# Altium project PCB_RX_V2.5_C.PrjPcb
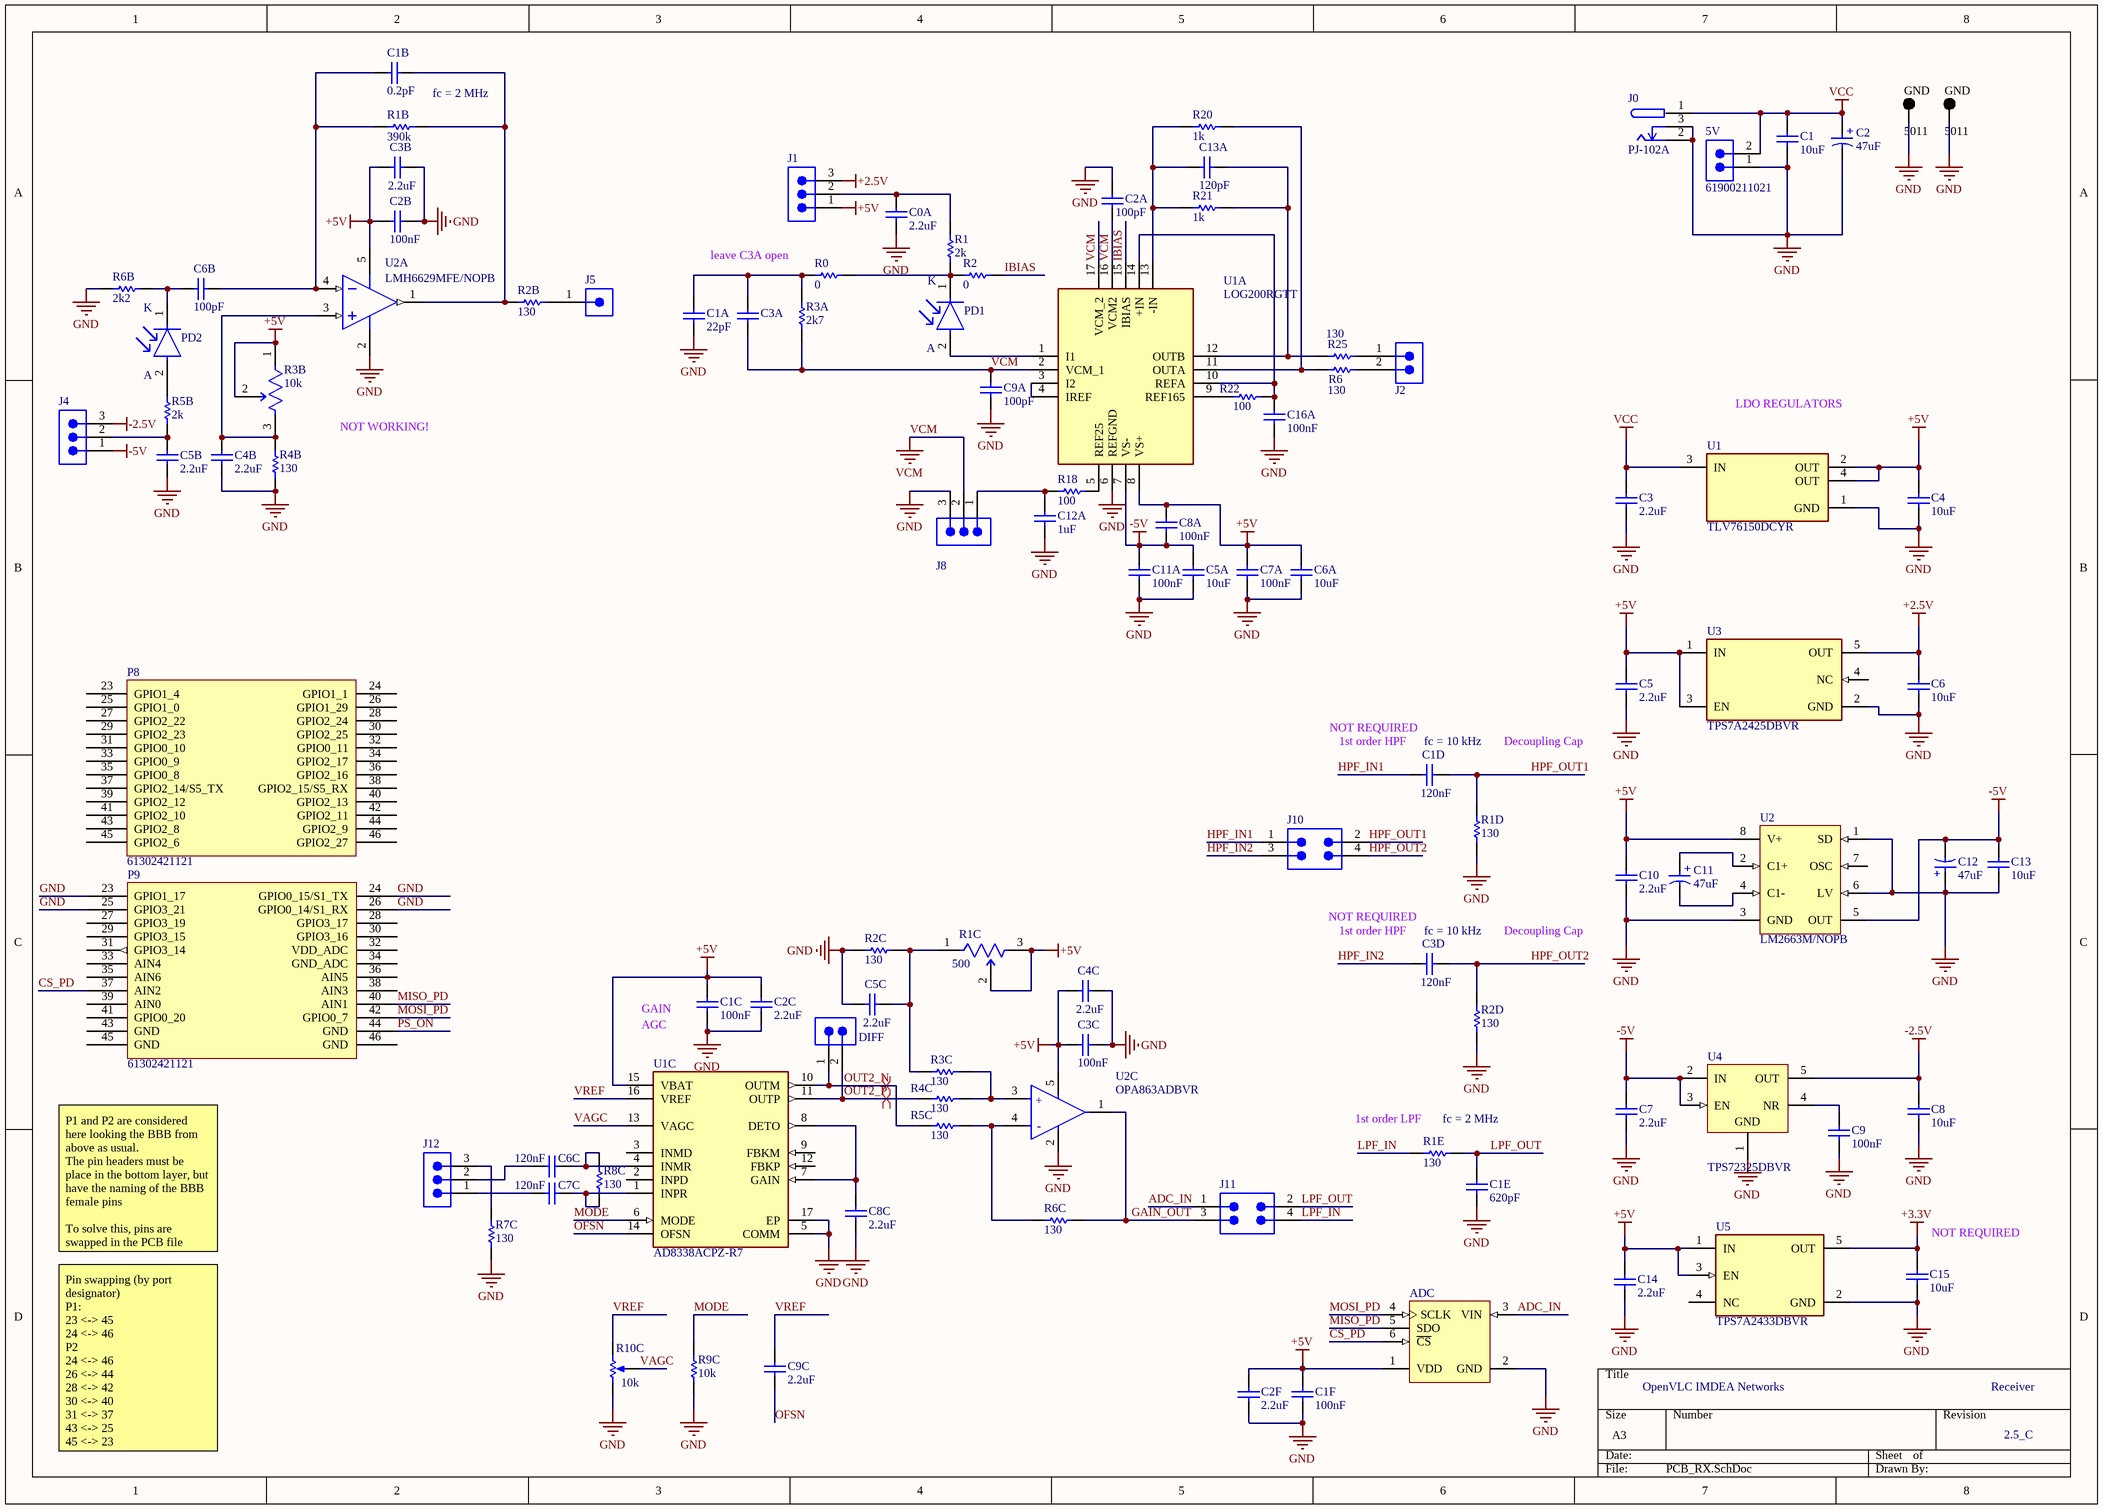
[diagram p0: PCB_RX.SchDoc]
1 sheet, 104 parts. Net scope: global (net labels, ports and power ports of the same name join across sheets).
Board file: PCB_RX.PcbDoc

## Sheet PCB_RX.SchDoc
size A3; SheetNumber: 1; SheetTotal: 1

### Parts
(Parts that share a designator on the sheet are numbered #1, #2 ... from top to bottom, then left to right.)
5V  61900211021  [61900211021]
ADC  ADS7886SBDBVR  [TI-DBV6_M]  (value not drawn)
C0A  value 2.2uF  [RESC1608X55N]  (hidden comment: Cap)
C1  value 10uF  [RESC1608X55N]  (hidden comment: Cap)
C1A  value 22pF  [RESC1608X55N]  (hidden comment: Cap)
C1B  value 0.2pF  [RESC1608X55N]  (hidden comment: Cap)
C1C  value 100nF  [RESC1608X55N]  (hidden comment: Cap)
C1D  value 120nF  [RESC1608X55N]  (hidden comment: Cap)
C1E  value 620pF  [RESC1608X55N]  (hidden comment: Cap)
C1F  value 100nF  [RESC1608X55N]  (hidden comment: Cap)
C2  47uF  [WCAP-PSLP_D5H5.5]
C2A  value 100pF  [RESC1608X55N]  (hidden comment: Cap)
C2B  value 100nF  [RESC1608X55N]  (hidden comment: Cap)
C2C  value 2.2uF  [RESC1608X55N]  (hidden comment: Cap)
C2F  value 2.2uF  [RESC1608X55N]  (hidden comment: Cap)
C3  value 2.2uF  [RESC1608X55N]  (hidden comment: Cap)
C3A  Cap  [RESC1608X55N]  (value not drawn)
C3B  value 2.2uF  [RESC1608X55N]  (hidden comment: Cap)
C3C  value 100nF  [RESC1608X55N]  (hidden comment: Cap)
C3D  value 120nF  [RESC1608X55N]  (hidden comment: Cap)
C4  value 10uF  [RESC1608X55N]  (hidden comment: Cap)
C4B  value 2.2uF  [RESC1608X55N]  (hidden comment: Cap)
C4C  value 2.2uF  [RESC1608X55N]  (hidden comment: Cap)
C5  value 2.2uF  [RESC1608X55N]  (hidden comment: Cap)
C5A  value 10uF  [RESC1608X55N]  (hidden comment: Cap)
C5B  value 2.2uF  [RESC1608X55N]  (hidden comment: Cap)
C5C  value 2.2uF  [RESC1608X55N]  (hidden comment: Cap)
C6  value 10uF  [RESC1608X55N]  (hidden comment: Cap)
C6A  value 10uF  [RESC1608X55N]  (hidden comment: Cap)
C6B  value 100pF  [RESC1608X55N]  (hidden comment: Cap)
C6C  value 120nF  [RESC1608X55N]  (hidden comment: Cap)
C7  value 2.2uF  [RESC1608X55N]  (hidden comment: Cap)
C7A  value 100nF  [RESC1608X55N]  (hidden comment: Cap)
C7C  value 120nF  [RESC1608X55N]  (hidden comment: Cap)
C8  value 10uF  [RESC1608X55N]  (hidden comment: Cap)
C8A  value 100nF  [RESC1608X55N]  (hidden comment: Cap)
C8C  value 2.2uF  [RESC1608X55N]  (hidden comment: Cap)
C9  value 100nF  [RESC1608X55N]  (hidden comment: Cap)
C9A  value 100pF  [RESC1608X55N]  (hidden comment: Cap)
C9C  value 2.2uF  [RESC1608X55N]  (hidden comment: Cap)
C10  value 2.2uF  [RESC1608X55N]  (hidden comment: Cap)
C11  47uF  [WCAP-PSLP_D5H5.5]
C11A  value 100nF  [RESC1608X55N]  (hidden comment: Cap)
C12  47uF  [WCAP-PSLP_D5H5.5]
C12A  value 1uF  [RESC1608X55N]  (hidden comment: Cap)
C13  value 10uF  [RESC1608X55N]  (hidden comment: Cap)
C13A  value 120pF  [RESC1608X55N]  (hidden comment: Cap)
C14  value 2.2uF  [RESC1608X55N]  (hidden comment: GRM188R6YA475KE15D)
C15  value 10uF  [RESC1608X55N]  (hidden comment: GRM188R6YA106MA73D)
C16A  value 100nF  [RESC1608X55N]  (hidden comment: Cap)
DIFF  61300211121  [61300211121]  (value not drawn)
GND#1  5011  [KSTN-5011_V]
GND#2  5011  [KSTN-5011_V]
J0  PJ-102A  [FP-PJ-102A-MFG]
J1  61300311121  [61300311121]  (value not drawn)
J2  61300211121  [61300211121]  (value not drawn)
J4  61300311121  [61300311121]  (value not drawn)
J5  61300111121  [61300111121]  (value not drawn)
J8  61300311121  [61300311121]  (value not drawn)
J10  61300421121  [61300421121]  (value not drawn)
J11  61300421121  [61300421121]  (value not drawn)
J12  61300311121  [61300311121]  (value not drawn)
P8  61302421121  [BBB_CAPE_NO_HEADER_R_24]
P9  61302421121  [BBB_CAPE_NO_HEADER_R_24]
PD1  BPW21R  [FP-6_511-5002_01-4-MFG]  (value not drawn)
PD2  BPW21R  [FP-6_511-5002_01-4-MFG]  (value not drawn)
R0  value 0  [RESC1608X55N]  (hidden comment: Res1)
R1  value 2k  [RESC1608X55N]  (hidden comment: Res1)
R1B  value 390k  [RESC1608X55N]  (hidden comment: Res1)
R1C  500  [FP-3296W-MFG]
R1D  value 130  [RESC1608X55N]  (hidden comment: Res1)
R1E  value 130  [RESC1608X55N]  (hidden comment: Res1)
R2  value 0  [RESC1608X55N]  (hidden comment: Res1)
R2B  value 130  [RESC1608X55N]  (hidden comment: Res1)
R2C  value 130  [RESC1608X55N]  (hidden comment: Res1)
R2D  value 130  [RESC1608X55N]  (hidden comment: Res1)
R3A  value 2k7  [RESC1608X55N]  (hidden comment: Res1)
R3B  10k  [FP-3296W-MFG]
R3C  value 130  [RESC1608X55N]  (hidden comment: Res1)
R4B  value 130  [RESC1608X55N]  (hidden comment: Res1)
R4C  value 130  [RESC1608X55N]  (hidden comment: Res1)
R5B  value 2k  [RESC1608X55N]  (hidden comment: Res1)
R5C  value 130  [RESC1608X55N]  (hidden comment: Res1)
R6  value 130  [RESC1608X55N]  (hidden comment: Res1)
R6B  value 2k2  [RESC1608X55N]  (hidden comment: Res1)
R6C  value 130  [RESC1608X55N]  (hidden comment: Res1)
R7C  value 130  [RESC1608X55N]  (hidden comment: Res1)
R8C  value 130  [RESC1608X55N]  (hidden comment: Res1)
R9C  value 10k  [RESC1608X55N]  (hidden comment: Res1)
R10C  10k  [BOUR-3362P]
R18  value 100  [RESC1608X55N]  (hidden comment: Res1)
R20  value 1k  [RESC1608X55N]  (hidden comment: Res1)
R21  value 1k  [RESC1608X55N]  (hidden comment: Res1)
R22  value 100  [RESC1608X55N]  (hidden comment: Res1)
R25  value 130  [RESC1608X55N]  (hidden comment: Res1)
U1  TLV76150DCYR  [FP-DCY0004A-MFG]
U1A  LOG200RGTT  [QFN50P300X300X100-17N-D]
U1C  AD8338ACPZ-R7  [FP-CP-16-22-IPC_C]
U2  LM2663M/NOPB  [D0008A_N]
U2A  LMH6629MFE/NOPB  [DBV0005A_L]
U2C  OPA863ADBVR  [FP-DBV0005A-MFG]
U3  TPS7A2425DBVR  [FP-DBV0005A-MFG]
U4  TPS72325DBVR  [DBV0005A_N]
U5  TPS7A2433DBVR  [FP-DBV0005A-MFG]

### Nets
+2.5V: C6.2 J1.3 U3.5(OUT)
+3.3V: C15.2 U5.5(OUT)
+5V: ADC.1(VDD) C1C.1 C1F.1 C2B.1 C2C.1 C2F.1 C3B.1 C3C.1 C4.2 C4C.1 C5.2 C6A.1 C7A.1 C8A.1 C10.2 C14.2 J1.1 R1C.2(WIPER) R1C.3(CW) R3B.1(CCW) R3B.2(WIPER) U1.2(OUT) U1.4(OUT) U1A.8(VS+) U1C.15(VBAT) U2.8(V+) U2A.5(V+) U2C.5(VS+) U3.1(IN) U3.3(EN) U5.1(IN) U5.3(EN)
-2.5V: C8.2 J4.3 U4.5(OUT)
-5V: C5A.1 C7.2 C8A.2 C11A.1 C12.2(N) C13.2 J4.1 U1A.7(VS-) U2.5(OUT) U4.2(IN) U4.3(EN)
GND: 5V.1 ADC.2(GND) C0A.1 C1.2 C1A.1 C1C.2 C1E.2 C1F.2 C2.2(N) C2A.1 C2B.2 C2C.2 C2F.2 C3.1 C3B.2 C3C.2 C4.1 C4B.1 C4C.2 C5.1 C5A.2 C5B.1 C5C.1 C6.1 C6A.2 C7.1 C7A.2 C8.1 C8C.1 C9.1 C9A.2 C10.1 C11A.2 C12.1(P) C12A.2 C13.1 C14.1 C15.1 C16A.2 GND#1.1 GND#2.1 J0.2 J0.3 J8.3 P9.23(GPIO1_17) P9.24(GPIO0_15/S1_TX) P9.25(GPIO3_21) P9.26(GPIO0_14/S1_RX) R1D.2 R2C.2 R2D.2 R4B.2 R6B.1 R7C.2 R9C.1 R10C.1(CCW) U1.1(GND) U1A.6(REFGND) U1C.5(COMM) U1C.17(EP) U2.1(SD) U2.3(GND) U2.6(LV) U2A.2(V-) U2C.2(VS-) U3.2(GND) U4.1(GND) U5.2(GND)
VCC: 5V.2 C1.1 C2.1(P) C3.2 J0.1 U1.3(IN)
VCM: C2A.2 C3A.2 C9A.1 J8.2 R3A.1 U1A.2(VCM_1) U1A.16(VCM2) U1A.17(VCM_2)
ADC_IN: ADC.3(VIN) J11.1
CS_PD: ADC.6(~{CS}) P9.37(AIN2)
GAIN_OUT: J11.3 R6C.1 U2C.1(VOUT)
HPF_IN1: C1D.1 J10.1
HPF_IN2: C3D.1 J10.3
HPF_OUT1: C1D.2 J10.2 R1D.1
HPF_OUT2: C3D.2 J10.4 R2D.1
IBIAS: R2.2 U1A.15(IBIAS)
LPF_IN: J11.4 R1E.2
LPF_OUT: C1E.1 J11.2 R1E.1
MISO_PD: ADC.5(SDO) P9.40(AIN1)
MODE: R9C.2 U1C.6(MODE)
MOSI_PD: ADC.4(SCLK) P9.42(GPIO0_7)
OFSN: C9C.1 U1C.14(OFSN)
OUT2_N: DIFF.1 R5C.2 U1C.10(OUTM)
OUT2_P: DIFF.2 R4C.2 U1C.11(OUTP)
PS_ON: P9.44(GND)
VAGC: R10C.2(S) U1C.13(VAGC)
VREF: C9C.2 R10C.3(CW) U1C.16(VREF)
NetC0A_2: C0A.2 J1.2 R1.2
NetC1A_2: C1A.2 C3A.1 R0.1 R3A.2
NetC1B_1: C1B.1 C6B.1 R1B.2 U2A.4(IN-)
NetC1B_2: C1B.2 R1B.1 R2B.2 U2A.1(OUT)
NetC4B_2: C4B.2 R3B.3(CW) R4B.1 U2A.3(IN+)
NetC5B_2: C5B.2 J4.2 R5B.2
NetC5C_2: C5C.2 R1C.1(CCW) R2C.1 R3C.2
NetC6B_2: C6B.2 PD2.1(C) R6B.2
NetC6C_1: C6C.1 J12.2
NetC6C_2: C6C.2 R8C.1 U1C.4(INMR)
NetC7C_1: C7C.1 J12.1
NetC7C_2: C7C.2 R8C.2 U1C.1(INPR)
NetC8C_2: C8C.2 U1C.7(GAIN) U1C.8(DETO)
NetC9_2: C9.2 U4.4(NR)
NetC11_1: C11.1(P) U2.2(C1+)
NetC11_2: C11.2(N) U2.4(C1-)
NetC12A_1: C12A.1 J8.1 R18.1
NetC13A_1: C13A.1 R20.1 R21.1 U1A.13(-IN)
NetC13A_2: C13A.2 R21.2 R25.2 U1A.12(OUTB)
NetC16A_1: C16A.1 R22.2 U1A.10(REFA) U1A.14(+IN)
NetJ2_1: J2.1 R25.1
NetJ2_2: J2.2 R6.1
NetJ5_1: J5.1 R2B.1
NetJ12_3: J12.3 R7C.1
NetPD1_1: PD1.1(C) R0.2 R1.1 R2.1
NetPD1_2: PD1.2(A) U1A.1(I1)
NetPD2_2: PD2.2(A) R5B.1
NetR3C_1: R3C.1 R4C.1 U2C.3(VIN+)
NetR5C_1: R5C.1 R6C.2 U2C.4(VIN-)
NetR6_2: R6.2 R20.2 U1A.11(OUTA)
NetR18_2: R18.2 U1A.5(REF25)
NetR22_1: R22.1 U1A.9(REF165)
NetU1A_3: U1A.3(I2) U1A.4(IREF)

Not connected (* = marked no-connect by the designer): P8 23(GPIO1_4) 24(GPIO1_1) 25(GPIO1_0) 26(GPIO1_29) 27(GPIO2_22) 28(GPIO2_24) 29(GPIO2_23) 30(GPIO2_25) 31(GPIO0_10) 32(GPIO0_11) 33(GPIO0_9) 34(GPIO2_17) 35(GPIO0_8) 36(GPIO2_16) 37(GPIO2_14/S5_TX) 38(GPIO2_15/S5_RX) 39(GPIO2_12) 40(GPIO2_13) 41(GPIO2_10) 42(GPIO2_11) 43(GPIO2_8) 44(GPIO2_9) 45(GPIO2_6) 46(GPIO2_27); P9 27(GPIO3_19) 28(GPIO3_17) 29(GPIO3_15) 30(GPIO3_16) 31(GPIO3_14) 32(VDD_ADC) 33(AIN4) 34(GND_ADC) 35(AIN6) 36(AIN5) 38(AIN3) 39(AIN0) 41(GPIO0_20) 43(GND) 45(GND) 46(GND); U1C 2(INPD) 3(INMD) 9(FBKM) 12(FBKP); U2 7(OSC); U3 4(NC); U5 4(NC)

### Layout directives
differential pair: OUT2_N, OUT2_P

### Notes on the sheet
- fc = 2 MHz
- K
- (near R0) leave C3A open
- A
- (near PD1) A
- NOT WORKING!
- LDO REGULATORS
- (near C1D) NOT REQUIRED
- (near C1D) 1st order HPF
- (near C1D) fc = 10 kHz
- Decoupling Cap
- NOT REQUIRED
- (near C3D) 1st order HPF
- (near C3D) fc = 10 kHz
- AGC
- (near C1C) GAIN
- (near R1E) 1st order LPF
- (near R1E) fc = 2 MHz
- P1 and P2 are considered here looking the BBB from above as usual.
  The pin headers must be place in the bottom layer, but have the naming of the BBB female pins
  To solve this, pins are swapped in the PCB file
- (near C15) NOT REQUIRED
- OpenVLC IMDEA Networks
- Receiver
- Pin swapping (by port designator)
  P1:
  23 <-> 45
  24 <-> 46
  P2
  24 <-> 46
  26 <-> 44
  28 <-> 42
  30 <-> 40
  31 <-> 37
  43 <-> 25
  45 <-> 23
- 2.5_C
- (in symbol CMP-00370-145533195-1) +; -
- (in symbol CMP-03913-53758736-1) +

### Library data of the parts
5V = CMP-1502-00592-2: NexarPartId: 18818217; Gender: Male; Insulation Resistance: 1GΩ; Voltage Rating: 250V; Contact Resistance: 20mΩ; Connector Type: Male Pin; Number of Positions: 2; Insulation: Insulated; Current Rating: 3A; Pitch: 2.54mm; Contact Mating Length: 7.62mm; Packaging: Bulk; Contact Plating: Tin; REACH SVHC: Unknown; Height: 3.2mm; Lead Pitch: 2.54mm; Color: Beige; Flammability Rating: UL94 V-0; RoHS: Compliant; Operating Supply Voltage: 250V; Length: 5.08mm; Number of Pins: 2; Max Operating Temperature: 105°C; Number of Rows: 1; Min Operating Temperature: -40°C; Contact Material: Copper; Mount: Through Hole; Housing Material: Nylon; Width: 5.12mm; Fastening Type: Friction; Contact Gender: Male; Number of Contacts: 2; Termination: Through Hole
ADC = CMP-0003-00246-2: 2.35 to 5.25 V, 12-Bit, 1 MSPS, Serial ADC, -40 to 125 degC, 6-pin SOT23 (DBV6), Green (RoHS & no Sb/Br); Manufacturer: Texas Instruments; Sample Rate (max)(SPS): 1M; INL(Max)(+/-LSB): 1.25; Digital Supply(Min)(V): 2.35; SNR(dB): 71.25; Interface: Serial SPI; Resolution(Bits): 12; SubFamily: Precision ADC (<=10MSPS); # Input Channels: 1; Digital Supply(Max)(V): 5.25; SFDR(dB): 85.5; Architecture: SAR; PackageDescription: 6-Pin Plastic Small Outline, Body 1.6 x 2.9 mm, Pitch 0.95 mm; ComponentLink1URL: http://www.ti.com/; PackageReference: DBV6; PartNumber: ADS7886SBDBVR; ComponentLink1Description: Manufacturer URL; ComponentLink2Description: Datasheet; Code_JEDEC: MO-178; ComponentLink3URL: http://www.ti.com/litv/pdf/mpds026h; ComponentLink2URL: http://www.ti.com/general/docs/lit/getliterature.tsp?genericPartNumber=ADS7886&fileType=pdf; ComponentLink3Description: Package Specification; Eco-Plan: Green (RoHS & no Sb/Br); Analog Voltage AV/DD(Min)(V): 2.35; DatasheetVersion: SLAS492A; SINAD(dB): 71.25; Mounting Technology: Surface Mount; PackageVersion: 4073253-5/K, 03/2006; Analog Voltage AV/DD(Max)(V): 5.25
C0A C1 C1A C1B C1C C1D C1E C1F C2A C2B C2C C2F C3 C3A C3B C3C C3D C4 C4B C4C C5 C5A C5B C5C C6 C6A C6B C6C C7 C7A C7C C8 C8A C8C C9 C9A C9C C10 C11A C12A C13 C13A C14 C15 C16A = Cap: Capacitor; Published: 8-Jun-2000; LatestRevisionDate: 17-Jul-2002; LatestRevisionNote: Re-released for DXP Platform.; PackageReference: RAD-0.3; Publisher: Altium Limited; PackageDescription: Radial Cap, Thru-Hole; 2 Leads; 0.3 in Pin Spacing
C2 C11 C12 = CMP-03913-53758736-1: 875105242006 WCAP-PSLP Aluminum Polymer Capacitors; Voltage Rating (DC): 10V; Life (Hours): 2000hours; ESR (Equivalent Series Resistance): 30mΩ; Ripple Current: 1.97A; Leakage Current: 300µA; Capacitance: 47µF; Polarity: Polar; Pitch: 5.3mm; Tolerance: 20%; Diameter: 5mm; Length: 5.5mm; RoHS: Compliant; Packaging: Tape & Reel (TR); Case/Package: Radial; REACH SVHC: Unknown; Max Operating Temperature: 105°C; Min Operating Temperature: -55°C; Mount: Surface Mount; Voltage Rating: 10V; Height - Seated (Max): 5.5118mm; NexarPartId: 53758736
DIFF J2 = CMP-1712-00002-6: NexarPartId: 20081794; Number of Contacts: 2; Pitch: 2.54mm; Connector Type: Male Pin; Voltage Rating: 250V; Current Rating: 3A; Gender: Male; Contact Resistance: 20mΩ; Height: 8.94mm; Lead Free: Lead Free; Number of Pins: 2; Termination: Through Hole; RoHS: Compliant; Lead Pitch: 2.54mm; REACH SVHC: No SVHC; Housing Material: PBT; Contact Mating Length: 5.9944mm; Min Operating Temperature: -40°C; Orientation: Vertical; Contact Material: Copper; Contact Gender: Male; Max Operating Temperature: 125°C; Number of Rows: 1; Number of Positions: 2; Packaging: Bulk; Contact Plating: Gold; Mount: Through Hole; Color: Black; Operating Supply Voltage: 250V
GND#1 GND#2 = CMP-1672-00003-4: Test Point, Black, Through Hole, RoHS, Bulk; Manufacturer: Keystone; ComponentLink2URL: http://www.keyelco.com/product-pdf.cfm?p=1320; Colour: Black; Pins: 1; REACH SVHC: No SVHC; ComponentLink1URL: http://www.keyelco.com/; PackageReference: 5011; Contact Plating: Silver; Package Quantity: 100; Packaging: Bulk; RoHSCompliant: true; Height: 8.12 mm; PackageDescription: 1-Pin Through Hole Device, Dia 3.17 mm; Mount: Through Hole; Mounting Technology: Through Hole; DatasheetVersion: Rev. F, 12/2013; ComponentLink1Description: Manufacturer URL; Contact Material: Bronze; ComponentLink2Description: Datasheet
J0 = CMP-12637-106234071-1: PJ-102A 2.0 x 6.5 mm, 2.5 A, Horizontal, Through Hole, Tapered Pins, Dc Power Jack Connector; Voltage Rating (DC): 24V; Number of Contacts: 3; Outside Diameter: 6.5mm; Gender: Male; Shielding: No; Insulation Resistance: 50MΩ; Current Rating: 2.5A; Inside Diameter: 2mm; Number of Conductors: 2; Housing Color: Black; RoHS: Compliant; Diameter: 2.1mm; Mount: Through Hole; Contact Plating: Nickel; NexarPartId: 106234071; Voltage Rating: 24V; Housing Material: Thermoplastic; Max Operating Temperature: 85°C; Color: Black; Contact Material: Copper, Nickel, Tin; Orientation: Horizontal; Packaging: Bulk; Flammability Rating: UL94 V-0; Schedule B: 8536695050, 8536695050; Contact Gender: Male; Lead Free: Lead Free; Termination: Through Hole; Min Operating Temperature: -25°C; Height: 11.2mm; Lifecycle Status: Production
J1 J4 J8 J12 = CMP-1502-01062-3: NexarPartId: 32855521; Current Rating: 3A; Voltage Rating: 250V; Number of Positions: 3; Pitch: 2.54mm; Contact Resistance: 20mΩ; Connector Type: Male Pin; Gender: Male; REACH SVHC: Unknown; Packaging: Bulk; Contact Material: Copper; Min Operating Temperature: -40°C; Number of Rows: 1; Orientation: Vertical; RoHS: Compliant; Contact Plating: Gold; Max Operating Temperature: 105°C; Mount: Through Hole; Height: 8.94mm; Operating Supply Voltage: 250V; Number of Pins: 3; Contact Mating Length: 5.9944mm; Number of Contacts: 3; Color: Black; Lead Free: Lead Free; Lead Pitch: 2.54mm; Termination: Solder
J5 = CMP-1502-01058-3: NexarPartId: 32855518; Current Rating: 3A; Connector Type: Male Pin; Number of Positions: 1; Contact Resistance: 20mΩ; Gender: Male; Operating Supply Voltage: 250V; Orientation: Vertical; Contact Mating Length: 5.9944mm; Termination: Solder; Number of Rows: 1; Number of Pins: 1; Mount: Through Hole; RoHS: Compliant; Contact Material: Copper; Color: Black; Lead Pitch: 2.54mm; Number of Contacts: 1; Contact Plating: Gold; Packaging: Bulk; REACH SVHC: Unknown
J10 J11 = CMP-1502-01066-4: NexarPartId: 32855524; Number of Positions: 4; Operating Supply Voltage: 250V; Pitch: 2.54mm; Connector Type: Male Pin; Current Rating: 3A; Contact Resistance: 20mΩ; Gender: Male; Number of Pins: 4; Max Operating Temperature: 105°C; Number of Contacts: 4; Contact Mating Length: 5.9944mm; Min Operating Temperature: -40°C; Orientation: Vertical; Height: 8.89mm; Mount: Through Hole; Lead Pitch: 2.54mm; Contact Material: Copper; Color: Black; Voltage Rating: 250V; RoHS: Compliant; Termination: Solder; Row Spacing: 2.54mm; Contact Plating: Gold; Number of Rows: 2; Lead Free: Lead Free; REACH SVHC: Unknown; Packaging: Bulk
P8 = BBB_P8_reduced
P9 = BBB_P9_reduced
PD1 PD2 = CMP-2000-05428-2: SENSOR PHOTODIODE 565NM RADIAL; Manufacturer: Vishay; Dark Current: 0.002uA; Viewing Angle: 100°; Max Junction Temp: +125°C; Response Time: 3.1us; Reverse Breakdown Voltage: 10V; Power Dissipation: 300mW; Forward Voltage: 1V; Forward Current: 50mA; Digikey Description: SENSOR PHOTODIODE 565NM RADIAL; RoHS: TRUE; Temperature: -40°C to +125°C; Device Class L1: Sensors; Device Class L2: Optical Sensors; Lead Free: Yes; Device Class L3: Photodiodes; Category: Diode; Manufacturer Part Number: BPW21R; Height: 3.3mm; Octopart: https://octopart.com/bpw21r-vishay-39390634; Sensor Output: Photodiode; Automotive: No; Package: 6.511-5002.01-4; Mouser Description: Photodiodes 50 Degree 300mW; Ambient Temperature Range Low: -40°C; Temperature Range Low: -40°C; Temperature Range High: +125°C; ComponentLink2URL: http://www.vishay.com/docs/81519/bpw21r.pdf; ComponentLink2Description: Datasheet; Wavelength: 565nm; Ambient Temperature Range High: +125°C
R0 R1 R1B R1D R1E R2 R2B R2C R2D R3A R3C R4B R4C R5B R5C R6 R6B R6C R7C R8C R9C R18 R20-R22 R25 = Res1: Resistor; Published: 8-Jun-2000; LatestRevisionDate: 17-Jul-2002; LatestRevisionNote: Re-released for DXP Platform.; PackageReference: AXIAL-0.3; Publisher: Altium Limited; PackageDescription: Axial Device, Thru-Hole; 2 Leads; 0.3 in Pin Spacing
R1C R3B = CMP-1747-00001-8: TRIMMER 10K OHM 0.5W PC PIN TOP; Number of Turns: 25; Tolerance: 10%; Resistance: 10kR; Max Power Dissipation: 500mW; Temperature Coefficient: 100ppm/°C; Insulation Resistance: 1GR; Min Operating Temperature: -55°C; Resistor Type: Cermet; Series: 3296; Color: Blue; Mount: Through Hole; Taper: Linear; Radiation Hardening: No; RoHS Compliant: Yes; Width: 9.53mm; Resistance Tolerance: 10%; Contact Plating: Tin; Military Standard: Not; Package Quantity: 50; Weight: 0.03oz; Lead Free: Lead Free; Power Rating: 500mW; Termination: Pin; Technology: CERMET; Max Operating Temperature: 125°C; Packaging: Rail/Tube; Length: 9.53mm; Depth: 4.83mm; Height: 11.55mm; Reach SVHC Compliant: Yes
R10C = CMP-1747-00004-1: Square Trimpot(R) Trimming Potentiometer, 10 KOhm, 300 V, -55 to 125 degC, 3-Pin THD, RoHS, Tube; Voltage Rating: 220 mV; Power Rating: 1 W; Tolerance: 1%; Resistance: 50 mohm; Case/Package: 1206; Length: 3.2 mm; RoHSCompliant: True; PackageDescription: 3-Pin Through Hole Device, Body 6.6 x 6.99 mm, Pitch 2.54 mm; ComponentLink2Description: Datasheet; REACH SVHC: No SVHC; Mount: Surface Mount; Height: 0.6 mm; Packaging: Tape and Reel; ComponentLink1URL: http://www.bourns.com/; Case Code (Imperial): 0612; Pins: 2; Case Code (Metric): 1632; ComponentLink2URL: http://www.bourns.com/docs/Product-Datasheets/3362.pdf; Min Operating Temperature: -25degC; ComponentLink1Description: Manufacturer URL; PackageReference: 3326P; Max Operating Temperature: 125degC; Width: 1.6 mm; Package Quantity: 5000; DatasheetVersion: May-16
U1 = CMP-00370-134324849-1: TLV76150DCYR 1-A 16-V high-PSRR linear voltage regulator 4-SOT-223 -40 to 125; Manufacturer Lifecycle Status: ACTIVE; Number of Channels: 1; Min Supply Voltage: 6.5V; Nominal Supply Current: 65µA; Dropout Voltage: 900mV; Accuracy: 1%; Max Supply Voltage: 16V; Max Junction Temperature (Tj): 125°C; Output Current: 1A; Output Voltage: 5V; Width: 3.5mm; Length: 6.5mm; NexarPartId: 134324849; Max Operating Temperature: 125°C; Thickness: 1.6mm; Min Operating Temperature: -40°C; Case/Package: SOT-223; Height: 1.8mm; Lifecycle Status: Production; Number of Pins: 4; Number of Outputs: 1
U1A = LOG200RGTT: Logarithmic Amplifiers High-speed precision logarithmic amplifier with photodiode bias and dark-current correction; Manufacturer_Name: Texas Instruments; Geometry.Height: 1mm; Manufacturer_Part_Number: LOG200RGTT; Mouser Part Number: *; Mouser Price/Stock: *; Arrow Part Number: *; Arrow Price/Stock: *; Datasheet Link: https://www.ti.com/lit/ds/symlink/log200.pdf?ts=1737720734287&ref_url=https%253A%252F%252Fwww.mouser.es%252F
U1C = CMP-09116-000032-1: IC OPAMP VGA 1 CIRCUIT 16LFCSP; Manufacturer: Analog Devices; Nominal Supply Current: 3-6mA; Max Supply Voltage: 5V; Number Of Channels: 1; Output Current Per Channel: 5mA; Max Junction Temp: +150°C; Min Supply Voltage: 3V; Bandwidth: 18MHz; Voltage Gain: 80dB; Mouser Description: Special Purpose Amplifiers Ultra Low Pwr 18MHz SGL CH VGA; Device Class L2: Linear ICs; Ipc Land Pattern Name: QFN50P300X300X75-16; Temperature Range Low: -40°C; Device Class L1: Integrated Circuits (ICs); RoHS: TRUE; Digikey Description: IC OPAMP VGA 1 CIRCUIT 16LFCSP; Category: IC; ComponentLink2URL: https://www.analog.com/media/en/technical-documentation/data-sheets/AD8338.pdf; Automotive: No; Height: 0.8mm; Manufacturer Part Number: AD8338ACPZ-R7; Octopart: https://octopart.com/ad8338acpz-r7-analog+devices-21054770; Temperature: -40°C to +85°C; ComponentLink2Description: Datasheet; Lead Free: Yes; Temperature Range High: +85°C; Package: CP-16-22; Device Class L3: Amplifiers - Op Amps
U2 = CMP-0065-00037-3: Switched Capacitor Voltage Converter, 8-pin Narrow SOIC, Pb-Free; Manufacturer: Texas Instruments; PackageTopMarking: NSZXTT*LM26*63M; CompType: Switch Caps; PowerWise: N; Code_IPC: SOIC127P600-8; PinCount: 8; ComponentLink1Description: Datasheet URL; PackageReference: D0008A; Code_JEDEC: MS-012-AA; PackageDescription: SOIC Narrow, 4.9 x 3.9 x 1.45mm, 8 Lead, 1.27mm Pitch; ComponentLink1URL: http://www.ti.com/general/docs/lit/getliterature.tsp?genericPartNumber=LM2663&fileType=pdf; RoHS: Y
U2A = CMP-0055-01619-3: Ultra-Low Noise, High-Speed Operational Amplifier with Shutdown, 5-pin SOT-23, 250 Reel; Manufacturer: Texas Instruments; High-Reliability: Y; PackageTopMarking: AE7A*XTT; CompType: Amplifiers; PackageDescription: Molded SOT-23, .115 x .063 x .040 in Body, 5 Lead, .0375 in Pitch; ComponentLink1Description: Datasheet URL; PartNumber: LMH6629MFE/NOPB; RoHS: Y; ComponentLink1URL: http://www.ti.com/general/docs/lit/getliterature.tsp?genericPartNumber=LMH6629&fileType=pdf; PowerWise: Y; PinCount: 5; Package Reference: DBV0005A
U2C = CMP-00370-145533195-1: OPA863ADBVR Single-channel, high-precision, low-power, 105-MHz, 12-V RRIO voltage-feedback amplifier 5-SOT-23 -40 to 125; Manufacturer Lifecycle Status: ACTIVE; Min Supply Voltage: 2.7V; Response Time: 70ns; Voltage Gain: 128dB; Input Offset Voltage (Vos): 10µV; Output Current per Channel: 30mA; Max Supply Voltage: 12.6V; Number of Channels: 1; Input Bias Current: 300nA; Nominal Supply Current: 800µA; Max Junction Temperature (Tj): 150°C; Bandwidth: 105MHz; Max Operating Temperature: 125°C; Length: 2.9mm; Ambient Temperature Range High: 125°C; Lifecycle Status: Production; Min Operating Temperature: -40°C; Thickness: 1.2mm; Case/Package: SOT-23; NexarPartId: 145533195; Height: 1.45mm; Number of Pins: 5; Width: 1.6mm
U3 = CMP-00370-106221449-1: TPS7A2425DBVR 200-mA, 18-V, ultra-low-IQ, low-dropout (LDO) voltage regulator with enable ; 5-SOT-23 -40 to 125; Manufacturer Lifecycle Status: ACTIVE; Max Supply Voltage: 18V; Dropout Voltage: 160mV; Number of Outputs: 1; Output Current: 200mA; Max Junction Temperature (Tj): 125°C; Output Voltage: 2.5V; Accuracy: 1.25%; Min Supply Voltage: 3V; Lifecycle Status: Production; NexarPartId: 106221449; Max Operating Temperature: 125°C; Thickness: 1.2mm; Min Operating Temperature: -40°C; Case/Package: SOT-23; Number of Channels: 1; Width: 1.6mm; Number of Pins: 5; Length: 2.9mm; Height: 1.45mm
U4 = CMP-0394-00292-2: Single Output High PSRR LDO, 200 mA, Fixed -2.5 V Output, -10 to -2.7 V Input, 5-pin SOT-23 (DBV), -40 to 125 degC, Green (RoHS & no Sb/Br); Manufacturer: Texas Instruments; Iout(Max)(A): 0.2; Iq(Typ)(mA): 0.13; Accuracy(%): 2; Vdo(Typ)(mV): 280; SubFamily: Single Channel LDO; Vin(Max)(V): -2.7; PartNumber: TPS72325DBVR; PackageReference: DBV0005A; ComponentLink3Description: Package Specification; Fixed Output Options(V): -2.5; ComponentLink1URL: http://www.ti.com/; ComponentLink1Description: Manufacturer URL; Mounting Technology: Surface Mount; PackageDescription: 5-Pin Plastic Small Outline, Body 1.60 Ãƒâ€” 2.90 mm, Pitch 0.95 mm; ComponentLink2URL: http://www.ti.com/general/docs/lit/getliterature.tsp?genericPartNumber=TPS72325&fileType=pdf; PackageVersion: 4073253-4/K; ComponentLink3URL: http://www.ti.com/litv/pdf/mpds018i; Vout Adj(Min)(V): -2.5; ComponentLink2Description: Datasheet; Vout Adj(Max)(V): -2.5; Eco-Plan: Green (RoHS & no Sb/Br); DatasheetVersion: SLVS346B; Vin(Min)(V): -10; Code_JEDEC: MO-178
U5 = CMP-00370-106221451-1: TPS7A2433DBVR 200-mA, 18-V, ultra-low-IQ, low-dropout (LDO) voltage regulator with enable ; 5-SOT-23 -40 to 125; Manufacturer Lifecycle Status: ACTIVE; Number of Channels: 1; Output Voltage: 3.3V; Number of Pins: 5; NexarPartId: 106221451; Lifecycle Status: Production; Thickness: 1.2mm; Length: 2.9mm; Height: 1.45mm; Case/Package: SOT-23; Width: 1.6mm